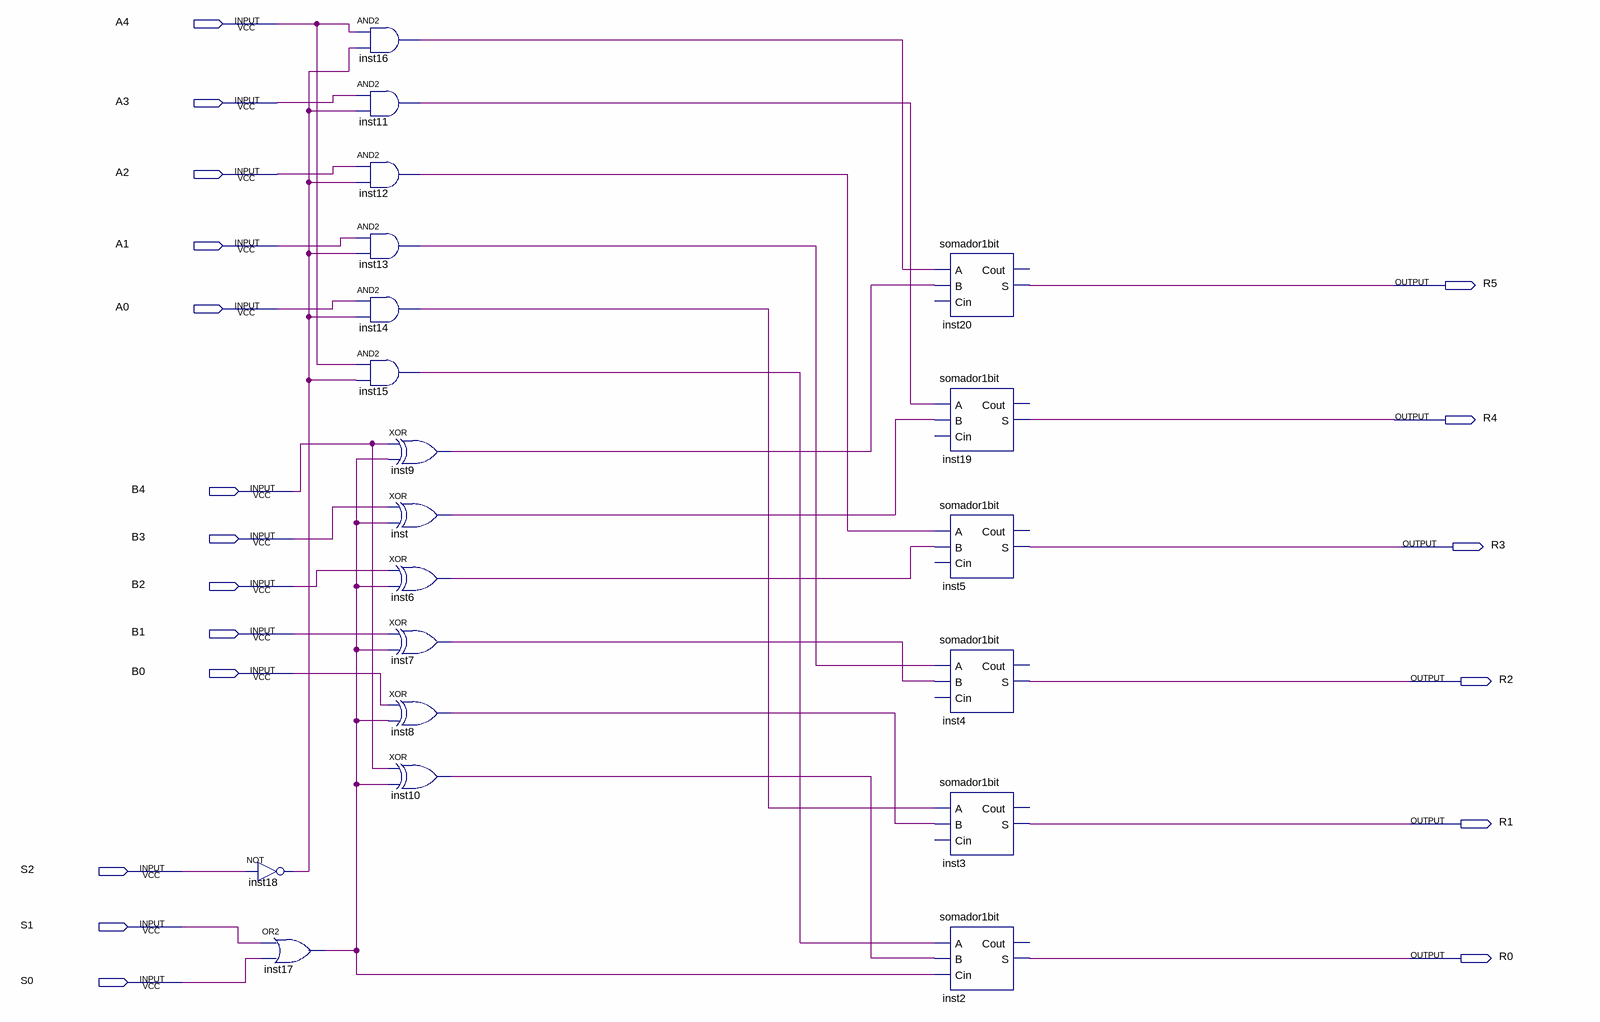
[diagram p0: schematic sheet]
// Quartus schematic nucleoAritimetico.bdf as structural Verilog: 20 symbols, 19 pins
module nucleoAritimetico (
  input  A4,
  input  A3,
  input  A2,
  input  A1,
  input  A0,
  input  B4,
  input  B3,
  input  B2,
  input  B1,
  input  B0,
  input  S2,
  input  S1,
  input  S0,
  output R5,
  output R4,
  output R3,
  output R2,
  output R1,
  output R0
);

  wire inst6_out, inst7_out, inst8_out, inst9_out, inst10_out, inst11_out, inst12_out, inst13_out,
       inst14_out, inst15_out, inst16_out, inst17_out, inst18_out, inst_out;

  not inst18 (inst18_out, S2);
  or inst17 (inst17_out, S1, S0);
  and inst16 (inst16_out, A4, inst18_out);
  and inst11 (inst11_out, A3, inst18_out);
  and inst12 (inst12_out, A2, inst18_out);
  and inst13 (inst13_out, A1, inst18_out);
  and inst14 (inst14_out, A0, inst18_out);
  and inst15 (inst15_out, A4, inst18_out);
  xor inst9 (inst9_out, B4, inst17_out);
  xor inst (inst_out, B3, inst17_out);
  xor inst6 (inst6_out, B2, inst17_out);
  xor inst7 (inst7_out, B1, inst17_out);
  xor inst8 (inst8_out, B0, inst17_out);
  xor inst10 (inst10_out, B4, inst17_out);
  somador1bit inst20 (.A(inst16_out), .B(inst9_out), .S(R5));  // open: Cin, Cout
  somador1bit inst19 (.A(inst11_out), .B(inst_out), .S(R4));  // open: Cin, Cout
  somador1bit inst5 (.A(inst12_out), .B(inst6_out), .S(R3));  // open: Cin, Cout
  somador1bit inst4 (.A(inst13_out), .B(inst7_out), .S(R2));  // open: Cin, Cout
  somador1bit inst3 (.A(inst14_out), .B(inst8_out), .S(R1));  // open: Cin, Cout
  somador1bit inst2 (.A(inst15_out), .B(inst10_out), .Cin(inst17_out), .S(R0));  // open: Cout
endmodule
